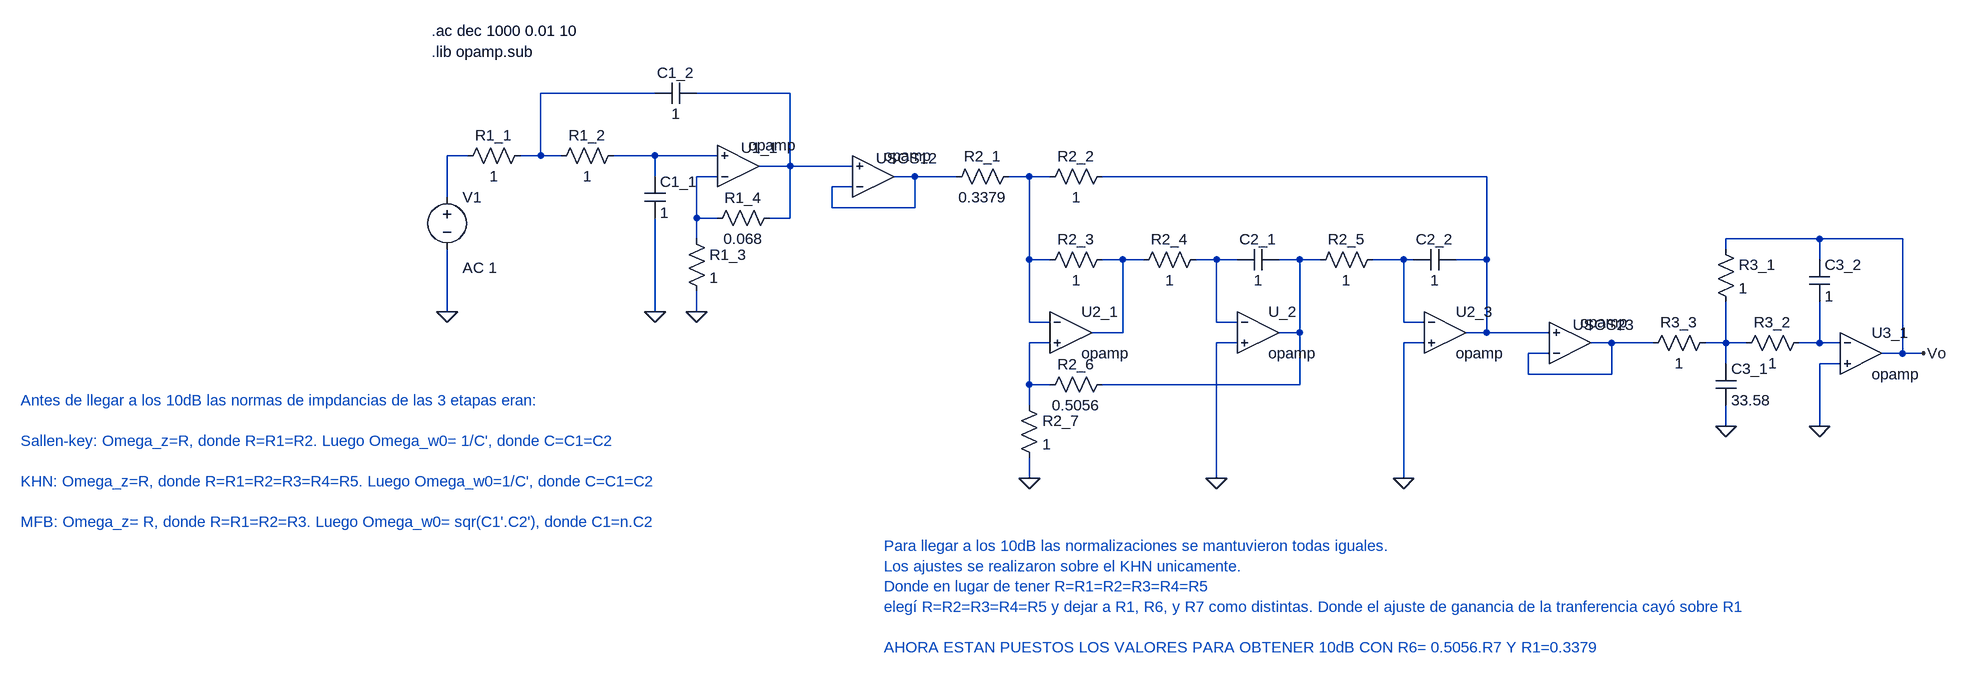
[diagram p0: schematic FPBJ_butterO6_TS2_KEILAKORJ.asc]
FPBJ_butterO6_TS2_KEILAKORJ.asc, the LTspice schematic file:
Version 4.1
SHEET 1 1792 884
WIRE -608 -368 -784 -368
WIRE -400 -368 -544 -368
WIRE -896 -272 -928 -272
WIRE -784 -272 -784 -368
WIRE -784 -272 -816 -272
WIRE -752 -272 -784 -272
WIRE -608 -272 -672 -272
WIRE -512 -272 -608 -272
WIRE -400 -256 -400 -368
WIRE -400 -256 -448 -256
WIRE -304 -256 -400 -256
WIRE -608 -240 -608 -272
WIRE -512 -240 -544 -240
WIRE -208 -240 -240 -240
WIRE -144 -240 -208 -240
WIRE -32 -240 -64 -240
WIRE 0 -240 -32 -240
WIRE 672 -240 80 -240
WIRE -304 -224 -336 -224
WIRE -928 -208 -928 -272
WIRE -336 -192 -336 -224
WIRE -208 -192 -208 -240
WIRE -208 -192 -336 -192
WIRE -544 -176 -544 -240
WIRE -512 -176 -544 -176
WIRE -400 -176 -400 -256
WIRE -400 -176 -432 -176
WIRE -544 -144 -544 -176
WIRE 1184 -144 1040 -144
WIRE 1312 -144 1184 -144
WIRE 1040 -128 1040 -144
WIRE -32 -112 -32 -240
WIRE 0 -112 -32 -112
WIRE 112 -112 80 -112
WIRE 144 -112 112 -112
WIRE 256 -112 224 -112
WIRE 288 -112 256 -112
WIRE 384 -112 352 -112
WIRE 416 -112 384 -112
WIRE 544 -112 496 -112
WIRE 560 -112 544 -112
WIRE 672 -112 672 -240
WIRE 672 -112 624 -112
WIRE 1184 -112 1184 -144
WIRE -928 -32 -928 -128
WIRE -608 -32 -608 -176
WIRE -544 -32 -544 -64
WIRE -32 -16 -32 -112
WIRE 0 -16 -32 -16
WIRE 256 -16 256 -112
WIRE 288 -16 256 -16
WIRE 544 -16 544 -112
WIRE 576 -16 544 -16
WIRE 112 0 112 -112
WIRE 112 0 64 0
WIRE 384 0 384 -112
WIRE 384 0 352 0
WIRE 672 0 672 -112
WIRE 672 0 640 0
WIRE 768 0 672 0
WIRE 0 16 -32 16
WIRE 288 16 256 16
WIRE 576 16 544 16
WIRE 864 16 832 16
WIRE 928 16 864 16
WIRE 1040 16 1040 -48
WIRE 1040 16 1008 16
WIRE 1072 16 1040 16
WIRE 1184 16 1184 -48
WIRE 1184 16 1152 16
WIRE 1216 16 1184 16
WIRE 768 32 736 32
WIRE 1312 32 1312 -144
WIRE 1312 32 1280 32
WIRE 1344 32 1312 32
WIRE 1040 48 1040 16
WIRE 1216 48 1184 48
WIRE 736 64 736 32
WIRE 864 64 864 16
WIRE 864 64 736 64
WIRE -32 80 -32 16
WIRE 0 80 -32 80
WIRE 384 80 384 0
WIRE 384 80 80 80
WIRE -32 112 -32 80
WIRE 1040 144 1040 112
WIRE 1184 144 1184 48
WIRE -32 224 -32 192
WIRE 256 224 256 16
WIRE 544 224 544 16
FLAG -544 -32 0
FLAG -608 -32 0
FLAG -928 -32 0
FLAG -32 224 0
FLAG 256 224 0
FLAG 544 224 0
FLAG 1184 144 0
FLAG 1040 144 0
FLAG 1344 32 Vo
SYMBOL res -800 -288 R90
WINDOW 0 0 56 VBottom 2
WINDOW 3 32 56 VTop 2
SYMATTR InstName R1_1
SYMATTR Value 1
SYMBOL res -656 -288 R90
WINDOW 0 0 56 VBottom 2
WINDOW 3 32 56 VTop 2
SYMATTR InstName R1_2
SYMATTR Value 1
SYMBOL res -560 -160 R0
SYMATTR InstName R1_3
SYMATTR Value 1
SYMBOL res -416 -192 R90
WINDOW 0 0 56 VBottom 2
WINDOW 3 32 56 VTop 2
SYMATTR InstName R1_4
SYMATTR Value 0.068
SYMBOL cap -624 -240 R0
SYMATTR InstName C1_1
SYMATTR Value 1
SYMBOL cap -544 -384 R90
WINDOW 0 0 32 VBottom 2
WINDOW 3 32 32 VTop 2
SYMATTR InstName C1_2
SYMATTR Value 1
SYMBOL OpAmps\\opamp -480 -192 M180
WINDOW 0 4 92 Left 2
SYMATTR InstName U1_1
SYMBOL voltage -928 -224 R0
WINDOW 123 24 124 Left 2
WINDOW 39 0 0 Left 0
SYMATTR Value2 AC 1
SYMATTR InstName V1
SYMATTR Value ""
SYMBOL OpAmps\\opamp -272 -176 M180
WINDOW 0 4 92 Left 2
SYMATTR InstName USOS12
SYMBOL cap 352 -128 R90
WINDOW 0 0 32 VBottom 2
WINDOW 3 32 32 VTop 2
SYMATTR InstName C2_1
SYMATTR Value 1
SYMBOL cap 624 -128 R90
WINDOW 0 0 32 VBottom 2
WINDOW 3 32 32 VTop 2
SYMATTR InstName C2_2
SYMATTR Value 1
SYMBOL res -48 -256 R90
WINDOW 0 0 56 VBottom 2
WINDOW 3 32 56 VTop 2
SYMATTR InstName R2_1
SYMATTR Value 0.3379
SYMBOL res 96 -256 R90
WINDOW 0 0 56 VBottom 2
WINDOW 3 32 56 VTop 2
SYMATTR InstName R2_2
SYMATTR Value 1
SYMBOL res 96 -128 R90
WINDOW 0 0 56 VBottom 2
WINDOW 3 32 56 VTop 2
SYMATTR InstName R2_3
SYMATTR Value 1
SYMBOL res 240 -128 R90
WINDOW 0 0 56 VBottom 2
WINDOW 3 32 56 VTop 2
SYMATTR InstName R2_4
SYMATTR Value 1
SYMBOL res 512 -128 R90
WINDOW 0 0 56 VBottom 2
WINDOW 3 32 56 VTop 2
SYMATTR InstName R2_5
SYMATTR Value 1
SYMBOL res 96 64 R90
WINDOW 0 0 56 VBottom 2
WINDOW 3 32 56 VTop 2
SYMATTR InstName R2_6
SYMATTR Value 0.5056
SYMBOL res -48 96 R0
SYMATTR InstName R2_7
SYMATTR Value 1
SYMBOL OpAmps\\opamp 32 -64 R0
SYMATTR InstName U2_1
SYMBOL OpAmps\\opamp 320 -64 R0
SYMATTR InstName U_2
SYMBOL OpAmps\\opamp 608 -64 R0
SYMATTR InstName U2_3
SYMBOL OpAmps\\opamp 800 80 M180
WINDOW 0 4 92 Left 2
SYMATTR InstName USOS23
SYMBOL res 1024 -144 R0
SYMATTR InstName R3_1
SYMATTR Value 1
SYMBOL res 1168 0 R90
WINDOW 0 0 56 VBottom 2
WINDOW 3 32 56 VTop 2
SYMATTR InstName R3_2
SYMATTR Value 1
SYMBOL res 1024 0 R90
WINDOW 0 0 56 VBottom 2
WINDOW 3 32 56 VTop 2
SYMATTR InstName R3_3
SYMATTR Value 1
SYMBOL cap 1024 48 R0
SYMATTR InstName C3_1
SYMATTR Value 33.58
SYMBOL cap 1168 -112 R0
SYMATTR InstName C3_2
SYMATTR Value 1
SYMBOL OpAmps\\opamp 1248 -32 R0
SYMATTR InstName U3_1
TEXT -952 -432 Left 2 !.lib opamp.sub
TEXT -952 -464 Left 2 !.ac dec 1000 0.01 10
TEXT -1584 104 Left 2 ;Antes de llegar a los 10dB las normas de impdancias de las 3 etapas eran:\n \nSallen-key: Omega_z=R, donde R=R1=R2. Luego Omega_w0= 1/C', donde C=C1=C2\n \nKHN: Omega_z=R, donde R=R1=R2=R3=R4=R5. Luego Omega_w0=1/C', donde C=C1=C2\n \nMFB: Omega_z= R, donde R=R1=R2=R3. Luego Omega_w0= sqr(C1'.C2'), donde C1=n.C2
TEXT -256 328 Left 2 ;Para llegar a los 10dB las normalizaciones se mantuvieron todas iguales.\nLos ajustes se realizaron sobre el KHN unicamente.\nDonde en lugar de tener R=R1=R2=R3=R4=R5\nelegí R=R2=R3=R4=R5 y dejar a R1, R6, y R7 como distintas. Donde el ajuste de ganancia de la tranferencia cayó sobre R1\n \nAHORA ESTAN PUESTOS LOS VALORES PARA OBTENER 10dB CON R6= 0.5056.R7 Y R1=0.3379

The netlist it stands for:
* FPBJ_butterO6_TS2_KEILAKORJ.asc
R1_1 N001 N003 1
R1_2 N004 N001 1
R1_3 N005 0 1
R1_4 N002 N005 0.068
C1_1 N004 0 1
C1_2 N002 N001 1
X§U1_1 N005 N004 N002 opamp Aol=100K GBW=10Meg  ; pins invin noninvin out
V1 N003 0 AC 1
X§USOS12 N006 N002 N006 opamp Aol=100K GBW=10Meg  ; pins invin noninvin out
C2_1 N011 N010 1
C2_2 N008 N012 1
R2_1 N007 N006 0.3379
R2_2 N008 N007 1
R2_3 N009 N007 1
R2_4 N010 N009 1
R2_5 N012 N011 1
R2_6 N011 N013 0.5056
R2_7 N013 0 1
X§U2_1 N007 N013 N009 opamp Aol=100K GBW=10Meg  ; pins invin noninvin out
X§U_2 N010 0 N011 opamp Aol=100K GBW=10Meg  ; pins invin noninvin out
X§U2_3 N012 0 N008 opamp Aol=100K GBW=10Meg  ; pins invin noninvin out
X§USOS23 N014 N008 N014 opamp Aol=100K GBW=10Meg  ; pins invin noninvin out
R3_1 Vo N015 1
R3_2 N016 N015 1
R3_3 N015 N014 1
C3_1 N015 0 33.58
C3_2 Vo N016 1
X§U3_1 N016 0 Vo opamp Aol=100K GBW=10Meg  ; pins invin noninvin out
.lib opamp.sub
.ac dec 1000 0.01 10
* Antes de llegar a los 10dB las normas de impdancias de las 3 etapas eran:
* Sallen-key: Omega_z=R, donde R=R1=R2. Luego Omega_w0= 1/C', donde C=C1=C2
* KHN: Omega_z=R, donde R=R1=R2=R3=R4=R5. Luego Omega_w0=1/C', donde C=C1=C2
* MFB: Omega_z= R, donde R=R1=R2=R3. Luego Omega_w0= sqr(C1'.C2'), donde C1=n.C2
* Para llegar a los 10dB las normalizaciones se mantuvieron todas iguales.
* Los ajustes se realizaron sobre el KHN unicamente.
* Donde en lugar de tener R=R1=R2=R3=R4=R5
* elegí R=R2=R3=R4=R5 y dejar a R1, R6, y R7 como distintas. Donde el ajuste de ganancia de la tranferencia cayó sobre R1
* AHORA ESTAN PUESTOS LOS VALORES PARA OBTENER 10dB CON R6= 0.5056.R7 Y R1=0.3379
.backanno
.end